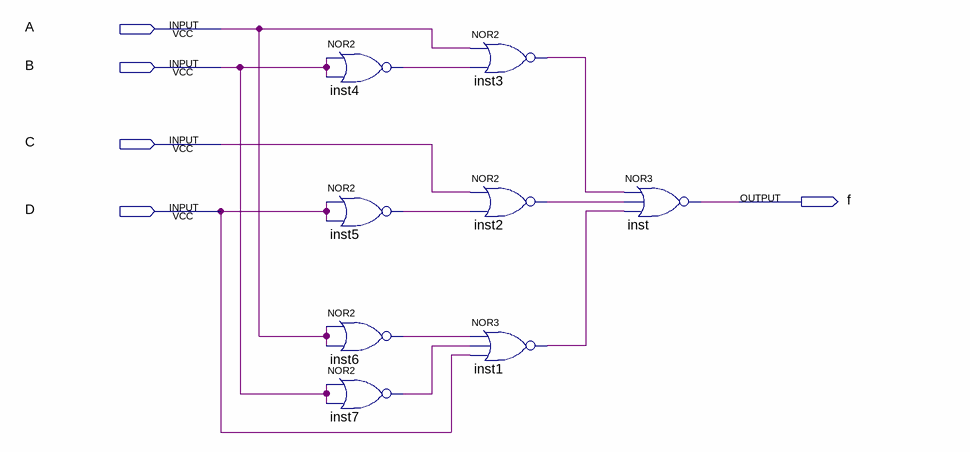
[diagram p0: schematic sheet]
// Quartus schematic Schematic.bdf as structural Verilog: 8 symbols, 5 pins
module Schematic (
  input  A,
  input  B,
  input  C,
  input  D,
  output f
);

  wire inst1_out, inst2_out, inst3_out, inst4_out, inst5_out, inst6_out, inst7_out;

  nor inst4 (inst4_out, B, B);
  nor inst5 (inst5_out, D, D);
  nor inst6 (inst6_out, A, A);
  nor inst7 (inst7_out, B, B);
  nor inst3 (inst3_out, A, inst4_out);
  nor inst2 (inst2_out, C, inst5_out);
  nor inst1 (inst1_out, inst6_out, inst7_out, D);
  nor inst (f, inst3_out, inst2_out, inst1_out);
endmodule
